# Altium schematic sheet ads1299.SchDoc
size A4; PageSetup: Record=PageOptions|CenterHorizontal=True|CenterVertical=True|PrintScale=0.97|XCorrection=1.00|YCorrection=1.00|PrintKind=2|BorderSize=5000000|LeftOffset=0|BottomOffset=0|Orientation=2|PaperLength=1000|PaperWidth=1000|Scale=100|PaperSource=7|PrintQuality=-3|MediaType=1|DitherType=10|PrintScaleMode=1|PaperKind=A4|PaperIndex=9
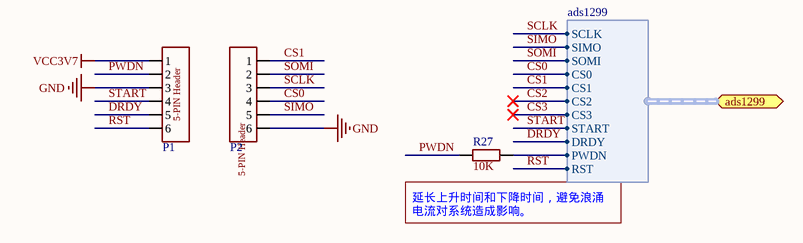
[diagram p0: ads1299.SchDoc]

## Parts
P1  Header 6  [排母1X6 2.54MM]  (value not drawn)
P2  Header 6  [排母1X6 2.54MM]  (value not drawn)
R27  value 10K  [R0402]  (hidden comment: Register)

## Ports
ads1299 (harness ads1299)

## Harnesses
ads1299: SCLK, SIMO, SOMI, CS0, CS1, CS2, CS3, START, DRDY, PWDN, RST

## Nets
GND: P1.3 P2.6
VCC3V7: P1.1
CS0: P2.4 ; port ads1299.CS0
CS1: P2.1 ; port ads1299.CS1
CS2: port ads1299.CS2
CS3: port ads1299.CS3
DRDY: P1.5 ; port ads1299.DRDY
PWDN: P1.2 R27.1
RST: P1.6 ; port ads1299.RST
SCLK: P2.3 ; port ads1299.SCLK
SIMO: P2.5 ; port ads1299.SIMO
SOMI: P2.2 ; port ads1299.SOMI
START: P1.4 ; port ads1299.START
NetR27_2: R27.2 ; port ads1299.PWDN

## Notes on the sheet
- (near R27) 延长上升时间和下降时间，避免浪涌电流对系统造成影响。
- (in symbol 排针/排母 1X6) 5-PIN Header

## Library data of the parts
P1 P2 = 排针/排母 1X6: Header, 6-Pin; LatestRevisionDate: 17-Jul-2002; LatestRevisionNote: Re-released for DXP Platform.; Publisher: Altium Limited
R27 = 贴片电阻